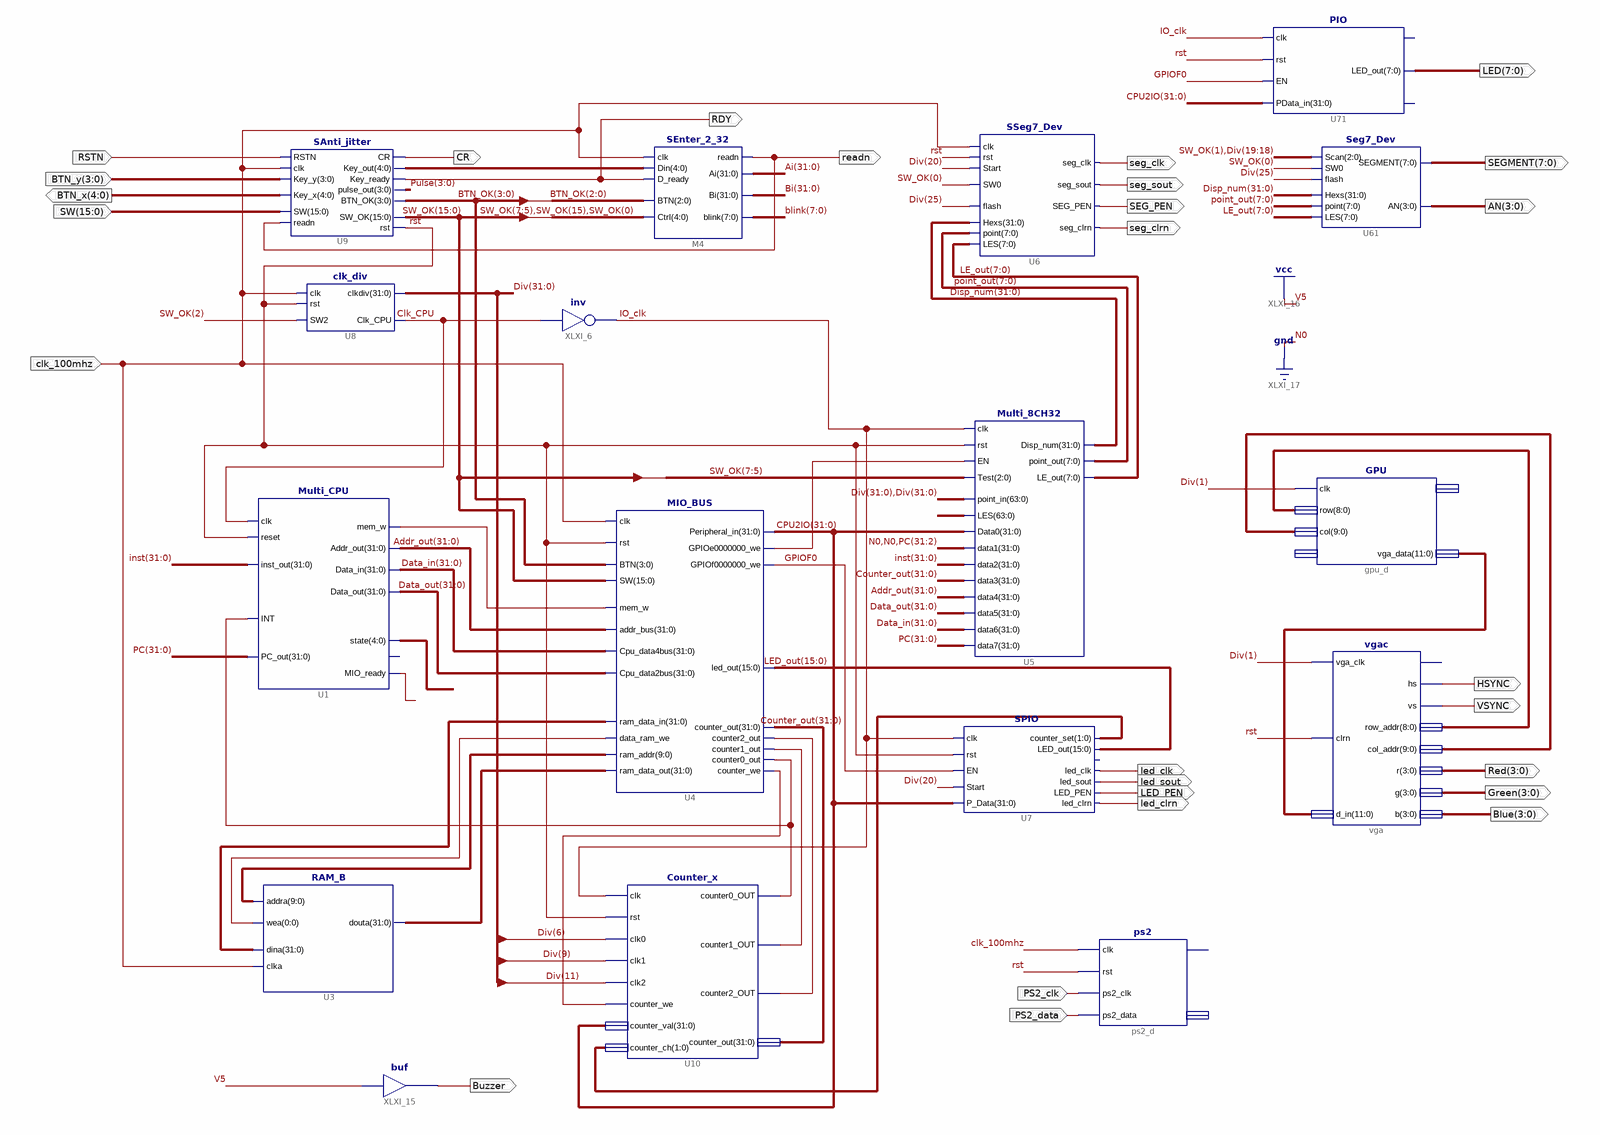
[diagram p0: schematic sheet 1]
// Xilinx ISE schematic top.sch (kintex7) as structural Verilog: 17 symbols, 27 ports
module top (
  input  RSTN,
  input  [3:0] BTN_y,
  input  [15:0] SW,
  input  clk_100mhz,
  input  PS2_clk,
  input  PS2_data,
  output [4:0] BTN_x,
  output CR,
  output RDY,
  output readn,
  output seg_clk,
  output seg_sout,
  output SEG_PEN,
  output seg_clrn,
  output Buzzer,
  output [7:0] SEGMENT,
  output [3:0] AN,
  output led_clk,
  output led_sout,
  output LED_PEN,
  output led_clrn,
  output [3:0] Red,
  output [3:0] Green,
  output [3:0] Blue,
  output HSYNC,
  output VSYNC,
  output [7:0] LED
);

  wire Clk_CPU, GPIOF0, IO_clk, rst, XLXN_86, XLXN_93, XLXN_99, XLXN_101, XLXN_103, XLXN_130;
  wire [0:0] XLXN_82;
  wire [1:0] XLXN_110;
  wire [3:0] BTN_OK, Pulse;
  wire [4:0] State, XLXN_5;
  wire [7:0] blink, LE_out, point_out;
  wire [8:0] XLXN_152;
  wire [9:0] XLXN_78, XLXN_153;
  wire [11:0] XLXN_151;
  wire [15:0] LED_out, SW_OK;
  wire [31:0] Addr_out, Ai, Bi, Counter_out, CPU2IO, Data_in, Data_out, Disp_num, Div, inst, PC, XLXN_80,
       XLXN_84;
  wire [63:0] XLXN_113;

  SAnti_jitter U9 (
    .SW(SW), .readn(readn), .Key_y(BTN_y), .Key_x(BTN_x), .RSTN(RSTN), .clk(clk_100mhz), .Key_out(XLXN_5),
    .Key_ready(RDY), .CR(CR), .rst(rst), .SW_OK(SW_OK), .pulse_out(Pulse), .BTN_OK(BTN_OK));
  SEnter_2_32 M4 (
    .readn(readn), .Ai(Ai), .Bi(Bi), .blink(blink), .Din(XLXN_5), .D_ready(RDY), .clk(clk_100mhz),
    .Ctrl({SW_OK[7:5], SW_OK[15], SW_OK[0]}), .BTN(BTN_OK[2:0]));
  SSeg7_Dev U6 (
    .LES(LE_out), .SEG_PEN(SEG_PEN), .seg_sout(seg_sout), .seg_clrn(seg_clrn), .point(point_out),
    .Hexs(Disp_num), .SW0(SW_OK[0]), .flash(Div[25]), .seg_clk(seg_clk), .clk(clk_100mhz), .rst(rst),
    .Start(Div[20]));
  clk_div U8 (.rst(rst), .clk(clk_100mhz), .SW2(SW_OK[2]), .clkdiv(Div), .Clk_CPU(Clk_CPU));
  not XLXI_6 (IO_clk, Clk_CPU);
  RAM_B U3 (.addra(XLXN_78), .clka(clk_100mhz), .wea(XLXN_82[0]), .dina(XLXN_84), .douta(XLXN_80));
  MIO_BUS U4 (
    .rst(rst), .clk(clk_100mhz), .mem_w(XLXN_86), .addr_bus(Addr_out), .Cpu_data4bus(Data_in),
    .Cpu_data2bus(Data_out), .ram_data_out(XLXN_80), .ram_addr(XLXN_78), .data_ram_we(XLXN_82[0]),
    .ram_data_in(XLXN_84), .counter_out(Counter_out), .counter2_out(XLXN_103), .counter1_out(XLXN_101),
    .counter0_out(XLXN_130), .counter_we(XLXN_99), .BTN(BTN_OK), .SW(SW_OK), .led_out(LED_out),
    .Peripheral_in(CPU2IO), .GPIOe0000000_we(XLXN_93), .GPIOf0000000_we(GPIOF0));
  Counter_x U10 (
    .clk(IO_clk), .rst(rst), .clk0(Div[6]), .clk1(Div[9]), .clk2(Div[11]), .counter_we(XLXN_99),
    .counter_val(CPU2IO), .counter_ch(XLXN_110), .counter0_OUT(XLXN_130), .counter1_OUT(XLXN_101),
    .counter2_OUT(XLXN_103), .counter_out(Counter_out));
  Multi_8CH32 U5 (
    .Test(SW_OK[7:5]), .point_in({Div, Div}), .EN(XLXN_93), .clk(IO_clk), .rst(rst), .LES(XLXN_113),
    .Data0(CPU2IO), .data1({2'b00, PC[31:2]}), .data2(inst), .data3(Counter_out), .data4(Addr_out),
    .data5(Data_out), .data6(Data_in), .data7(PC), .point_out(point_out), .LE_out(LE_out), .Disp_num(Disp_num));
  SPIO U7 (
    .clk(IO_clk), .P_Data(CPU2IO), .rst(rst), .EN(GPIOF0), .Start(Div[20]), .led_clk(led_clk),
    .LED_out(LED_out), .counter_set(XLXN_110), .led_clrn(led_clrn), .LED_PEN(LED_PEN), .led_sout(led_sout));  // open: GPIOf0
  Seg7_Dev U61 (
    .LES(LE_out), .Scan({SW_OK[1], Div[19:18]}), .SEGMENT(SEGMENT), .AN(AN), .point(point_out),
    .flash(Div[25]), .SW0(SW_OK[0]), .Hexs(Disp_num));
  buf XLXI_15 (Buzzer, 1'b1);
  Multi_CPU U1 (
    .clk(Clk_CPU), .reset(rst), .inst_out(inst), .INT(XLXN_130), .Addr_out(Addr_out), .mem_w(XLXN_86),
    .Data_out(Data_out), .Data_in(Data_in), .PC_out(PC), .MIO_ready(1'b1), .state(State));  // open: CPU_MIO
  vgac vga (
    .vga_clk(Div[1]), .clrn(rst), .d_in(XLXN_151), .hs(HSYNC), .vs(VSYNC), .row_addr(XLXN_152),
    .col_addr(XLXN_153), .r(Red), .g(Green), .b(Blue));  // open: rdn
  PIO U71 (.clk(IO_clk), .rst(rst), .EN(GPIOF0), .PData_in(CPU2IO), .LED_out(LED));  // open: GPIOf0, counter_set
  GPU gpu_d (.clk(Div[1]), .row(XLXN_152), .col(XLXN_153), .vga_data(XLXN_151));  // open: vram_data, vram_addr
  ps2 ps2_d (.clk(clk_100mhz), .rst(rst), .ps2_clk(PS2_clk), .ps2_data(PS2_data));  // open: ready, data_out
endmodule
